# Altium schematic sheet Stack Header.SchDoc: Stack Header
size Letter; SheetNumber: 11; SheetTotal: 11
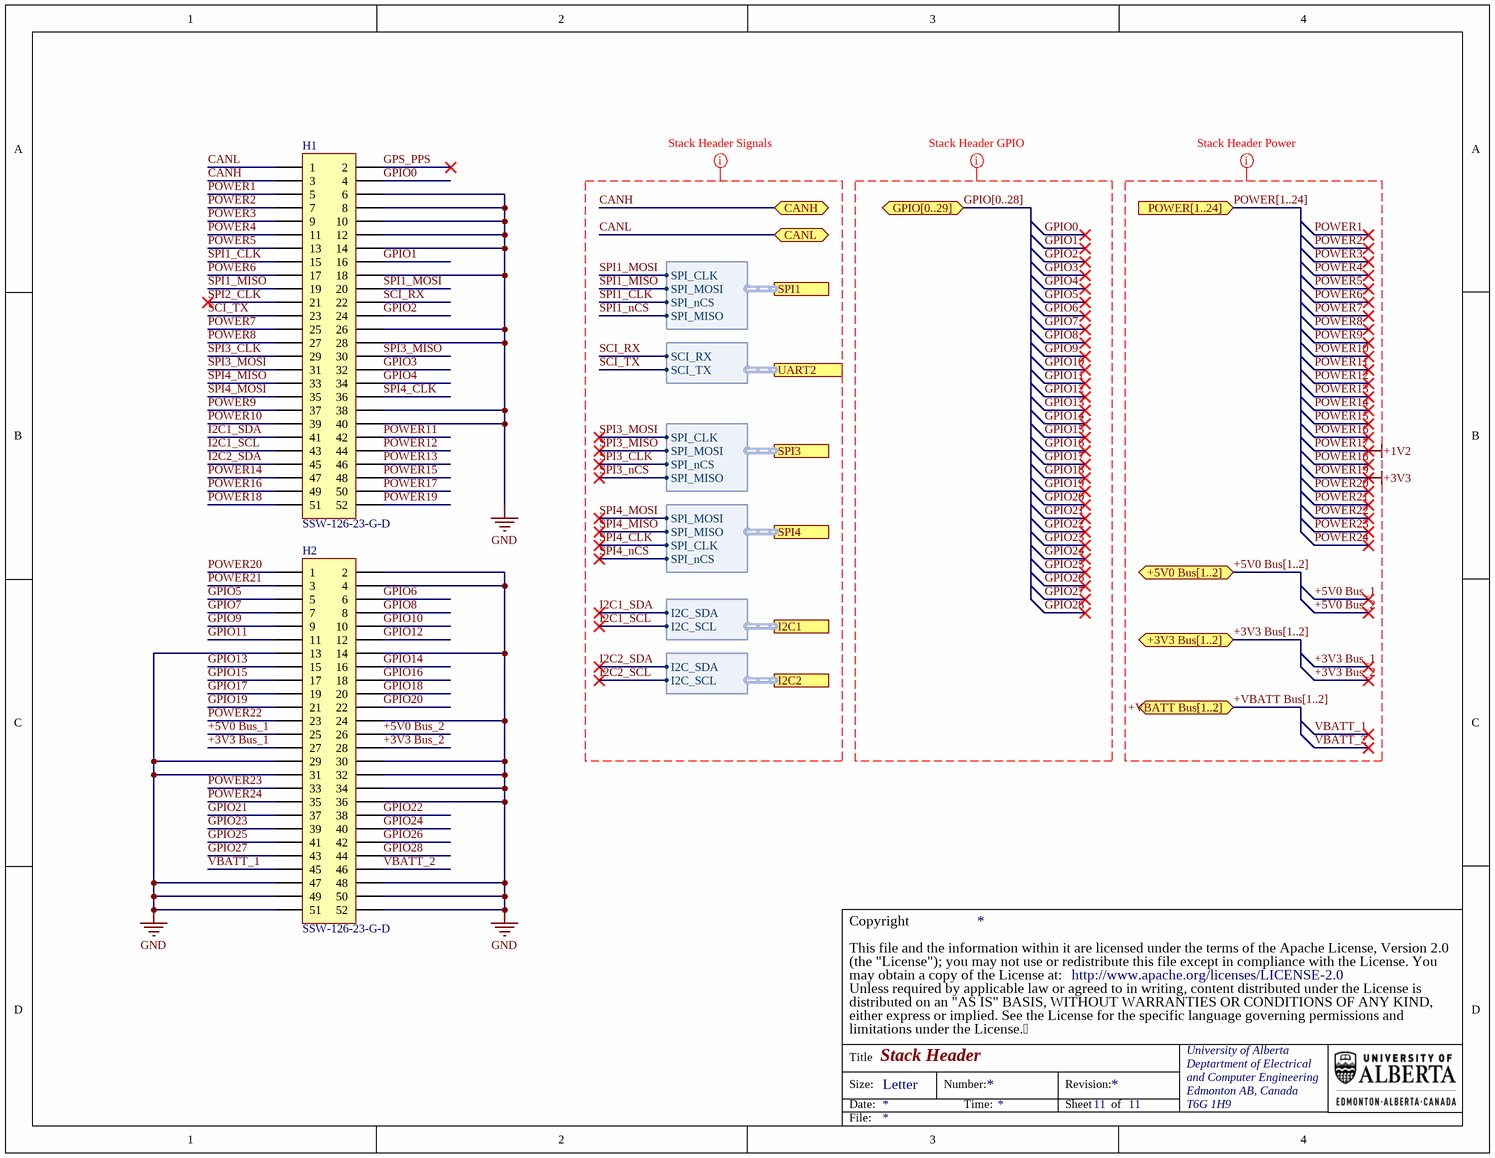
[diagram p0: Stack Header.SchDoc]

## Parts
H1  SSW-126-23-G-D  [SSW-126-23-G-D]
H2  SSW-126-23-G-D  [SSW-126-23-G-D]

## Ports
+3V3 Bus[1..2] (bidir), +5V0 Bus[1..2] (bidir), +VBATT Bus[1..2] (bidir), CANH (bidir), CANL (bidir), GPIO[0..29] (bidir), I2C1 (harness STACK_I2C1), I2C2 (harness STACK_I2C0), POWER[1..24] (in), SPI1 (harness STACK_SPI1), SPI3 (harness STACK_SPI3), SPI4 (harness STACK_SPI0), UART2 (harness STACK_UART2)

## Harnesses
STACK_SPI1: SPI_MOSI, SPI_MISO, SPI_CLK, SPI_nCS
STACK_I2C0: I2C_SDA, I2C_SCL
STACK_I2C1: I2C_SDA, I2C_SCL
STACK_UART2: SCI_RX, SCI_TX
STACK_SPI3: SPI_MOSI, SPI_MISO, SPI_CLK, SPI_nCS
STACK_SPI0: SPI_MOSI, SPI_MISO, SPI_CLK, SPI_nCS

## Nets
GND: H1.6 H1.8 H1.10 H1.12 H1.14 H1.18 H1.26 H1.28 H1.38 H1.40 H2.2 H2.4 H2.13 H2.14 H2.24 H2.29 H2.30 H2.31 H2.32 H2.34 H2.36 H2.47 H2.48 H2.49 H2.50 H2.51 H2.52
POWER17: H1.50  [also labelled +1V2]
POWER19: H1.52  [also labelled +3V3]
+3V3 Bus_1: H2.27
+3V3 Bus_2: H2.28
+5V0 Bus_1: H2.25
+5V0 Bus_2: H2.26
CANH: H1.3 ; port CANH
CANL: H1.1 ; port CANL
GPIO0: H1.4
GPIO1: H1.16
GPIO2: H1.24
GPIO3: H1.32
GPIO4: H1.34
GPIO5: H2.5
GPIO6: H2.6
GPIO7: H2.7
GPIO8: H2.8
GPIO9: H2.9
GPIO10: H2.10
GPIO11: H2.11
GPIO12: H2.12
GPIO13: H2.15
GPIO14: H2.16
GPIO15: H2.17
GPIO16: H2.18
GPIO17: H2.19
GPIO18: H2.20
GPIO19: H2.21
GPIO20: H2.22
GPIO21: H2.37
GPIO22: H2.38
GPIO23: H2.39
GPIO24: H2.40
GPIO25: H2.41
GPIO26: H2.42
GPIO27: H2.43
GPIO28: H2.44
GPS_PPS: H1.2
I2C1_SCL: H1.43 ; port I2C1.I2C_SCL
I2C1_SDA: H1.41 ; port I2C1.I2C_SDA
I2C2_SCL: port I2C2.I2C_SCL
I2C2_SDA: H1.45 ; port I2C2.I2C_SDA
POWER1: H1.5
POWER2: H1.7
POWER3: H1.9
POWER4: H1.11
POWER5: H1.13
POWER6: H1.17
POWER7: H1.25
POWER8: H1.27
POWER9: H1.37
POWER10: H1.39
POWER11: H1.42
POWER12: H1.44
POWER13: H1.46
POWER14: H1.47
POWER15: H1.48
POWER16: H1.49
POWER18: H1.51
POWER20: H2.1
POWER21: H2.3
POWER22: H2.23
POWER23: H2.33
POWER24: H2.35
SCI_RX: H1.22 ; port UART2.SCI_RX
SCI_TX: H1.23 ; port UART2.SCI_TX
SPI1_CLK: H1.15 ; port SPI1.SPI_nCS
SPI1_MISO: H1.19 ; port SPI1.SPI_MOSI
SPI1_MOSI: H1.20 ; port SPI1.SPI_CLK
SPI1_nCS: port SPI1.SPI_MISO
SPI2_CLK: H1.21
SPI3_CLK: H1.29 ; port SPI3.SPI_nCS
SPI3_MISO: H1.30 ; port SPI3.SPI_MOSI
SPI3_MOSI: H1.31 ; port SPI3.SPI_CLK
SPI3_nCS: port SPI3.SPI_MISO
SPI4_CLK: H1.36 ; port SPI4.SPI_CLK
SPI4_MISO: H1.33 ; port SPI4.SPI_MISO
SPI4_MOSI: H1.35 ; port SPI4.SPI_MOSI
SPI4_nCS: port SPI4.SPI_nCS
VBATT_1: H2.45
VBATT_2: H2.46

## Buses and harness runs
bus +3V3 Bus[1..2] = port +3V3 Bus[1..2]
bus +5V0 Bus[1..2] = port +5V0 Bus[1..2]
bus +VBATT Bus[1..2] = port +VBATT Bus[1..2]
bus GPIO[0..28] = port GPIO[0..29]
bus POWER[1..24] = port POWER[1..24]

## Layout directives
mark named Stack Header Signals: CANH, CANL, I2C1_SCL, I2C1_SDA, I2C2_SCL, I2C2_SDA, SCI_RX, SCI_TX, SPI1_CLK, SPI1_MISO, SPI1_MOSI, SPI1_nCS, SPI3_CLK, SPI3_MISO, SPI3_MOSI, SPI3_nCS, SPI4_CLK, SPI4_MISO, SPI4_MOSI, SPI4_nCS
mark named Stack Header GPIO: GPIO0, GPIO1, GPIO2, GPIO3, GPIO4, GPIO5, GPIO6, GPIO7, GPIO8, GPIO9, GPIO10, GPIO11, GPIO12, GPIO13, GPIO14, GPIO15, GPIO16, GPIO17, GPIO18, GPIO19, GPIO20, GPIO21, GPIO22, GPIO23, GPIO24, GPIO25, GPIO26, GPIO27, GPIO28, GPIO[0..28]
mark named Stack Header Power: +1V2, +3V3, +3V3 Bus[1..2], +3V3 Bus_1, +3V3 Bus_2, +5V0 Bus[1..2], +5V0 Bus_1, +5V0 Bus_2, +VBATT Bus[1..2], POWER1, POWER2, POWER3, POWER4, POWER5, POWER6, POWER7, POWER8, POWER9, POWER10, POWER11, POWER12, POWER13, POWER14, POWER15, POWER16, POWER17, POWER18, POWER19, POWER20, POWER21, POWER22, POWER23, POWER24, POWER[1..24], VBATT_1, VBATT_2

## Notes on the sheet
- (the "License"); you may not use or redistribute this file except in compliance with the License. You
- This file and the information within it are licensed under the terms of the Apache License, Version 2.0
- Copyright
- Unless required by applicable law or agreed to in writing, content distributed under the License is
- distributed on an "AS IS" BASIS, WITHOUT WARRANTIES OR CONDITIONS OF ANY KIND,
- either express or implied. See the License for the specific language governing permissions and
- limitations under the License.
- may obtain a copy of the License at:
- http://www.apache.org/licenses/LICENSE-2.0
- Title
- Size:
- Date:
- Letter
- Number:
- Time:
- Revision:
- Sheet
- of
- University of Alberta
- Deptartment of Electrical
- and Computer Engineering
- Edmonton AB, Canada
- T6G 1H9
- File:

## Library data of the parts
H1 H2 = PP-SAM-00002: Index: 3; Designator: P?; Part Number: PP-SAM-00002; Manufacturer Part Number: SSW-126-23-G-D; Supplier Part Number 1: SSW-126-23-G-D; Supplier 1: Samtec; Publisher: AlbertaSat; Published: 2018-06-07; LatestRevisionDate: 2018-06-07; LatestRevisionNote: ...; Supplier Link: #https://www.samtec.com/products/ssw-126-23-g-d#